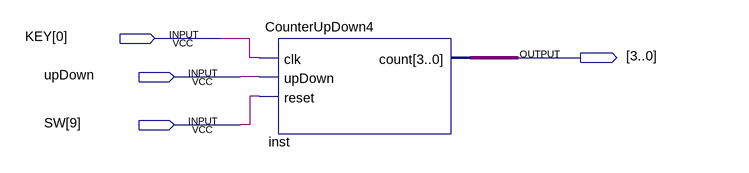
[diagram p0: schematic sheet]
// Quartus schematic CounterDown4.bdf as structural Verilog: 1 symbols, 4 pins
module CounterDown4 (
  input  [0:0] KEY,
  input  upDown,
  input  [9:9] SW
);

  wire [3:0] inst_count;

  CounterUpDown4 inst (.clk(KEY[0]), .upDown(upDown), .reset(SW[9]), .count(inst_count));
endmodule
